# EAGLE schematic MetaPixel3-Full (EAGLE 7.2.0)
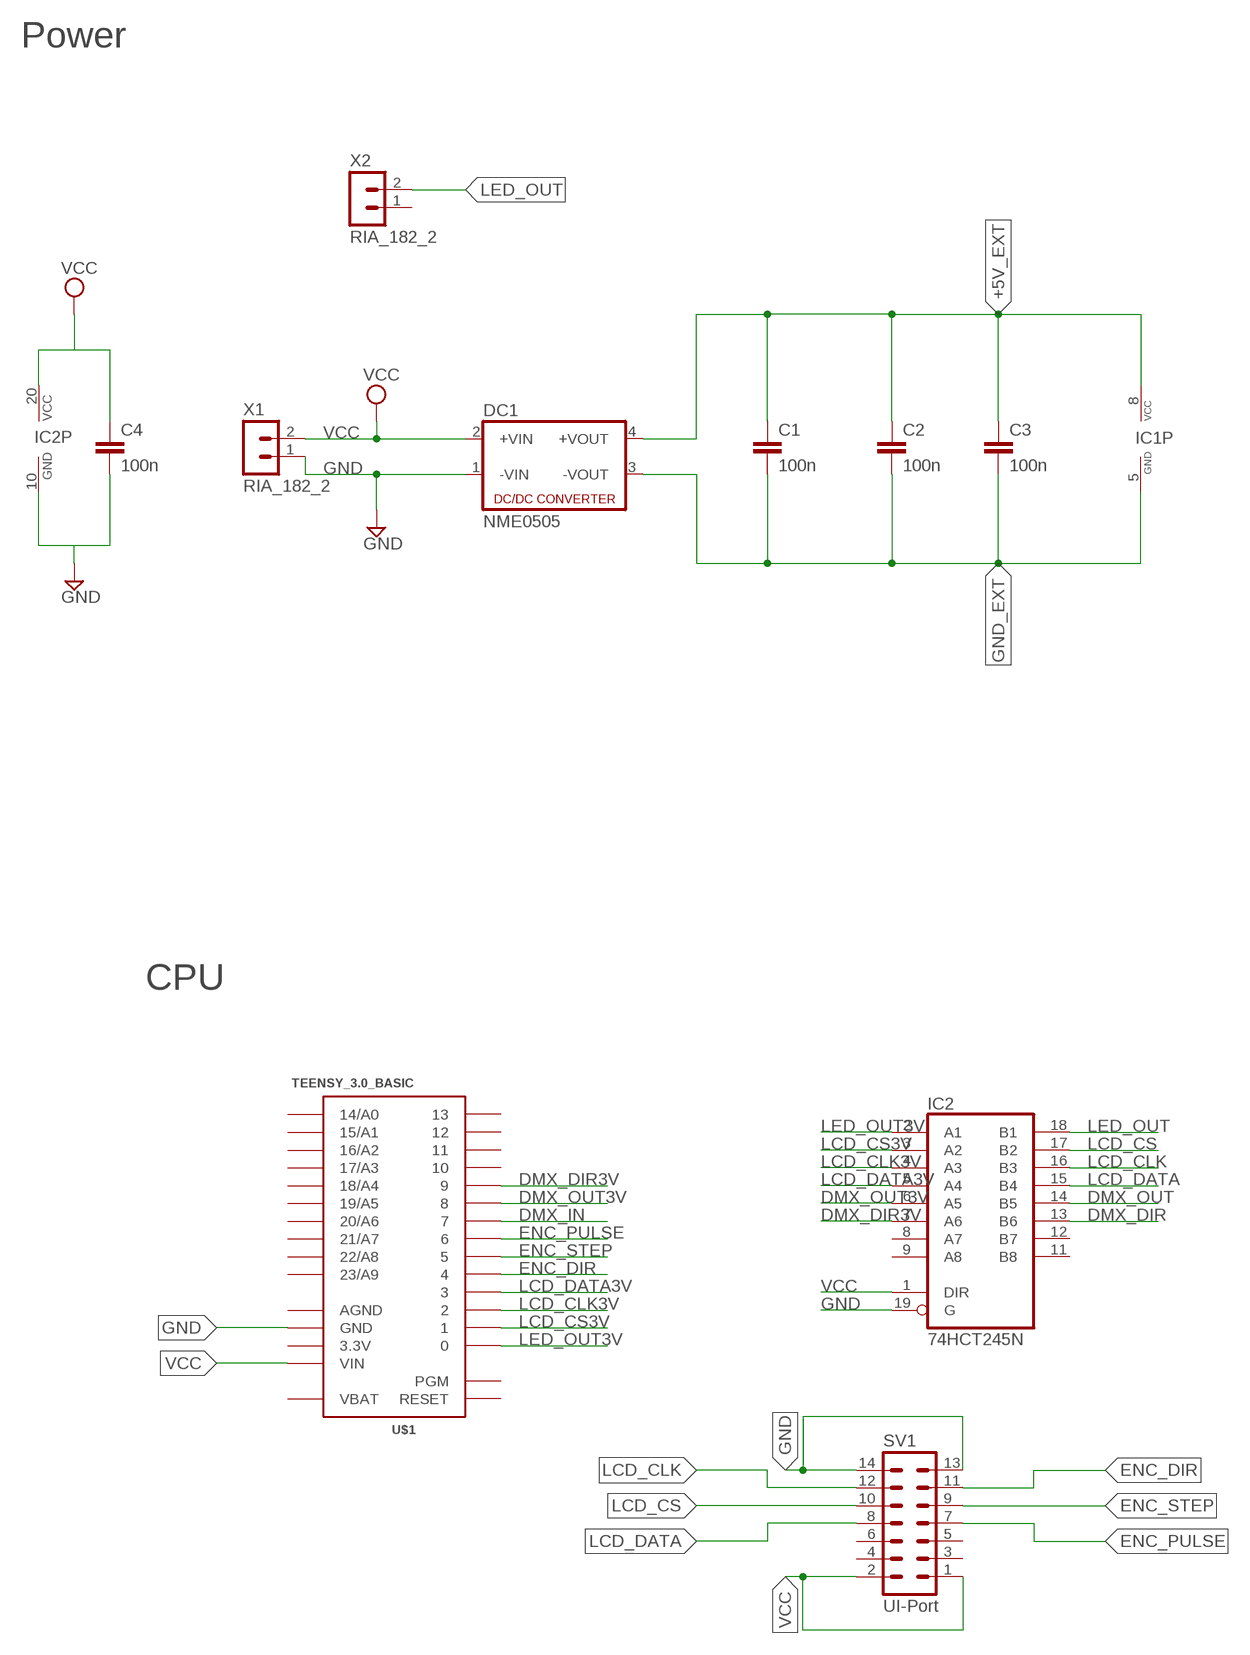
[diagram p0: schematic, sheet 1, part 1 of 2]
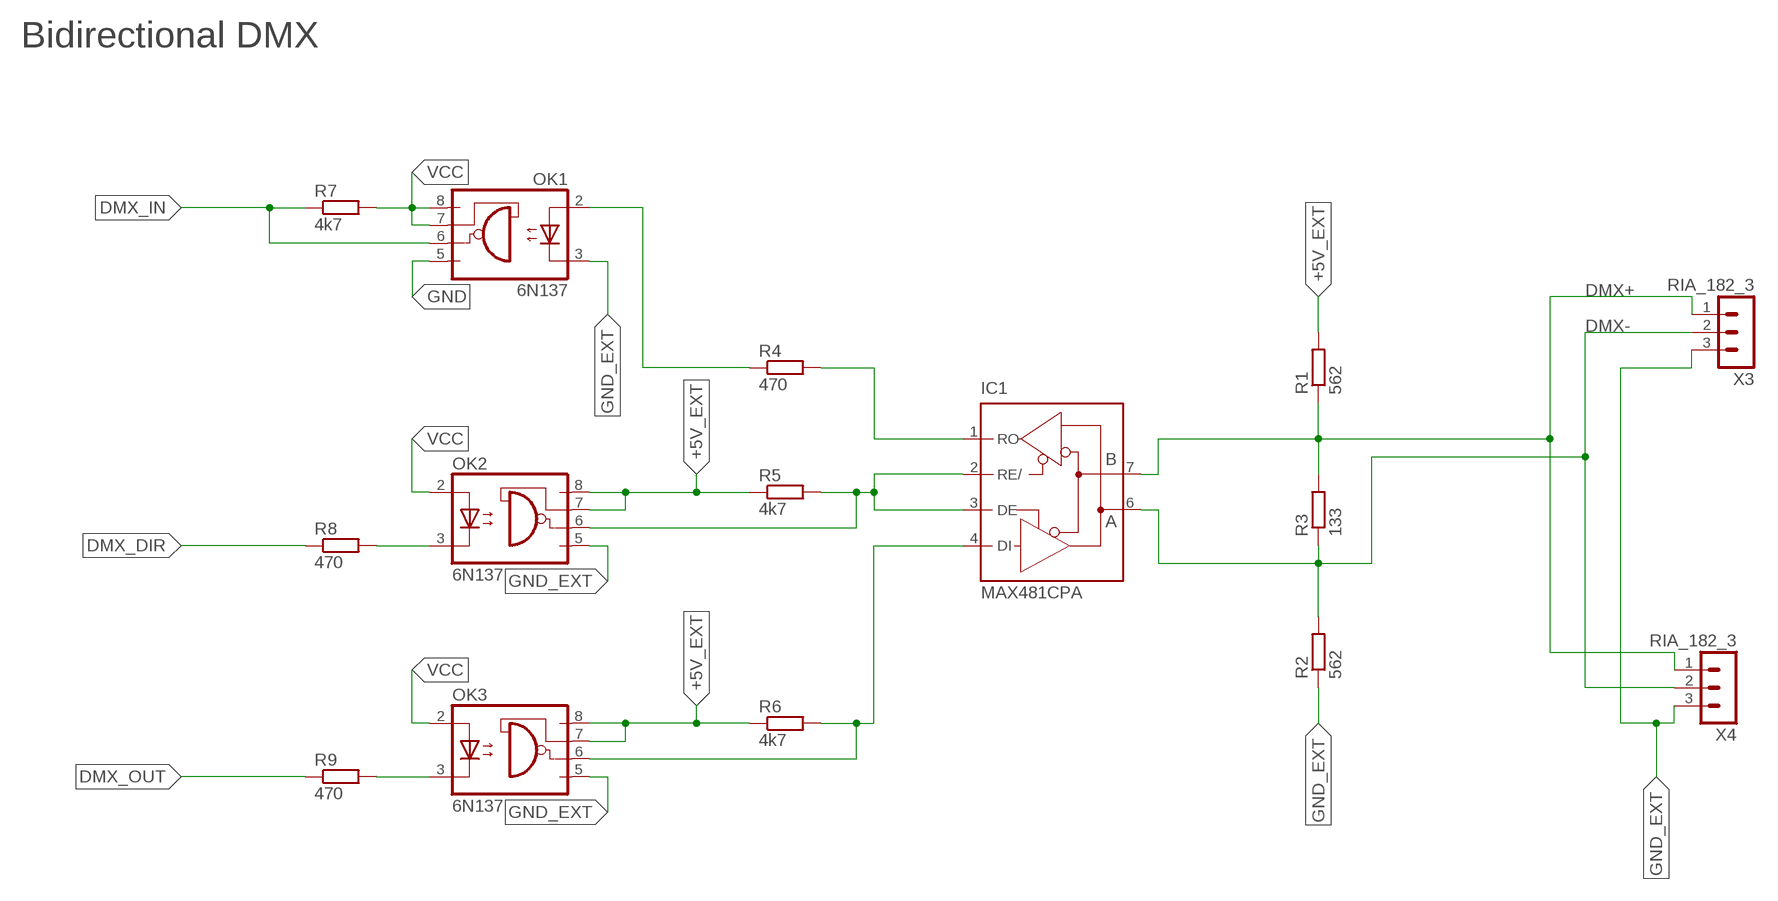
[diagram p1: schematic, sheet 1, part 2 of 2]

## Parts
C1  100n  C-EU025-030X050  [C025-030X050]
C2  100n  C-EU025-030X050  [C025-030X050]
C3  100n  C-EU025-030X050  [C025-030X050]
C4  100n  C-EU025-030X050  [C025-030X050]
DC1  NME0505  NME  [NME]
IC1  MAX481CPA  [DIL08]
IC2  74HCT245N  [DIL20]
OK1  6N137  [DIL08]
OK2  6N137  [DIL08]
OK3  6N137  [DIL08]
R1  562  R-EU_0207/7  [0207/7]
R2  562  R-EU_0207/7  [0207/7]
R3  133  R-EU_0207/7  [0207/7]
R4  470  R-EU_0207/10  [0207/10]
R5  4k7  R-EU_0207/10  [0207/10]
R6  4k7  R-EU_0207/10  [0207/10]
R7  4k7  R-EU_0207/10  [0207/10]
R8  470  R-EU_0207/10  [0207/10]
R9  470  R-EU_0207/10  [0207/10]
SV1  UI-Port  ML14  [ML14]
U$1  TEENSY_3.0_BASIC  [TEENSY_3.0_BASIC]
X1  RIA_182_2  [RIA_182_2]
X2  RIA_182_2  [RIA_182_2]
X3  RIA_182_3  [RIA_182_3]
X4  RIA_182_3  [RIA_182_3]

## Nets
+5V_EXT [SUPPLY]: C1.1 C2.1 C3.1 DC1.4(+VOUT) IC1.8(VCC) OK2.7(VE) OK2.8(VCC) OK3.7(VE) OK3.8(VCC) R1.2 R5.1 R6.1
DMX+: IC1.7(B) R1.1 R3.2 X3.1 X4.1
DMX-: IC1.6(A) R2.2 R3.1 X3.2 X4.2
DMX_DIR: IC2.13(B6) R8.1
DMX_DIR3V: IC2.7(A6) U$1.9
DMX_IN: OK1.6(VO) R7.1 U$1.7
DMX_OUT: IC2.14(B5) R9.1
DMX_OUT3V: IC2.6(A5) U$1.8
ENC_DIR: SV1.11 U$1.4
ENC_PULSE: SV1.7 U$1.6
ENC_STEP: SV1.9 U$1.5
GND [SUPPLY]: C4.2 DC1.1(-VIN) IC2.10(GND) IC2.19(G) OK1.5(GND) SV1.13 SV1.14 U$1.GND U$1.GND1(GND) X1.1
GND_EXT [SUPPLY]: C1.2 C2.2 C3.2 DC1.3(-VOUT) IC1.5(GND) OK1.3(C) OK2.5(GND) OK3.5(GND) R2.1 X3.3 X4.3
LCD_CLK: IC2.16(B3) SV1.12
LCD_CLK3V: IC2.4(A3) U$1.2
LCD_CS: IC2.17(B2) SV1.10
LCD_CS3V: IC2.3(A2) U$1.1
LCD_DATA: IC2.15(B4) SV1.8
LCD_DATA3V: IC2.5(A4) U$1.3
LED_OUT: IC2.18(B1) X2.2
LED_OUT3V: IC2.2(A1) U$1.0
N$1: OK1.2(A) R4.1
N$2: IC1.1(RO) R4.2
N$3: IC1.2(RE/) IC1.3(DE) OK2.6(VO) R5.2
N$4: IC1.4(DI) OK3.6(VO) R6.2
N$5: OK3.3(C) R9.2
N$6: OK2.3(C) R8.2
VCC [SUPPLY]: C4.1 DC1.2(+VIN) IC2.1(DIR) IC2.20(VCC) OK1.7(VE) OK1.8(VCC) OK2.2(A) OK3.2(A) R7.2 SV1.1 SV1.2 U$1.VIN X1.2
Unconnected: IC2.8(A7) IC2.9(A8) IC2.11(B8) IC2.12(B7) SV1.3 SV1.4 SV1.5 SV1.6 U$1.10 U$1.11 U$1.12 U$1.13 U$1.14/A0 U$1.15/A1 U$1.16/A2 U$1.17/A3 U$1.18/A4 U$1.19/A5 U$1.20/A6 U$1.21/A7 U$1.22/A8 U$1.23/A9 U$1.PGM U$1.RESET X2.1

## Notes on the sheet
- Bidirectional DMX
- Power
- CPU

## Power pins joined to a net without a drawn wire
3.3V: U$1.3.3V U$1.3.3V1(3.3V)
AGND: U$1.AGND
VBAT: U$1.VBAT

## Library data of the parts
C1-C4 = rcl:C-EU: CAPACITOR, European symbol
DC1 = dc-dc-converter:NME: DC-DC CONVERTER; MF: C & D TECHNOLOGIES, INC; MPN: NME1205D; OC_FARNELL: 1021466; OC_NEWARK: 98B8198
IC1 = maxim:MAX481CPA: RS485 TRANSEIVER; MPN: MAX481CPA+; OC_FARNELL: unknown; OC_NEWARK: 99K3445
IC2 = 74xx-eu:74*245: Octal BUS TRANSCEIVER, 3-state
OK1-OK3 = optocoupler:6N137: MOTOROLA OPTO COUPLER; MPN: 6N137; OC_FARNELL: 1328376; OC_NEWARK: 52M1895
R1-R3 R7-R9 = resistor:R-EU_: RESISTOR, European symbol
R4-R6 = rcl:R-EU_: RESISTOR, European symbol
SV1 = con-harting-ml:ML14: HARTING; OC_FARNELL: unknown; OC_NEWARK: unknown
U$1 = Teensy3.0:TEENSY_3.0_BASIC: Basic Teensy 3.0 with none of the 'inner' pins enabled. See '+4', 'AllAnalogPins", and 'AllPins' packages for additional pin holes, as needed.
X1 X2 = BlaBlub_USER:RIA_182_2
X3 X4 = BlaBlub_USER:RIA_182_3

## Net classes
0 default: width 0.2 mm
1 SUPPLY: width 0.4 mm